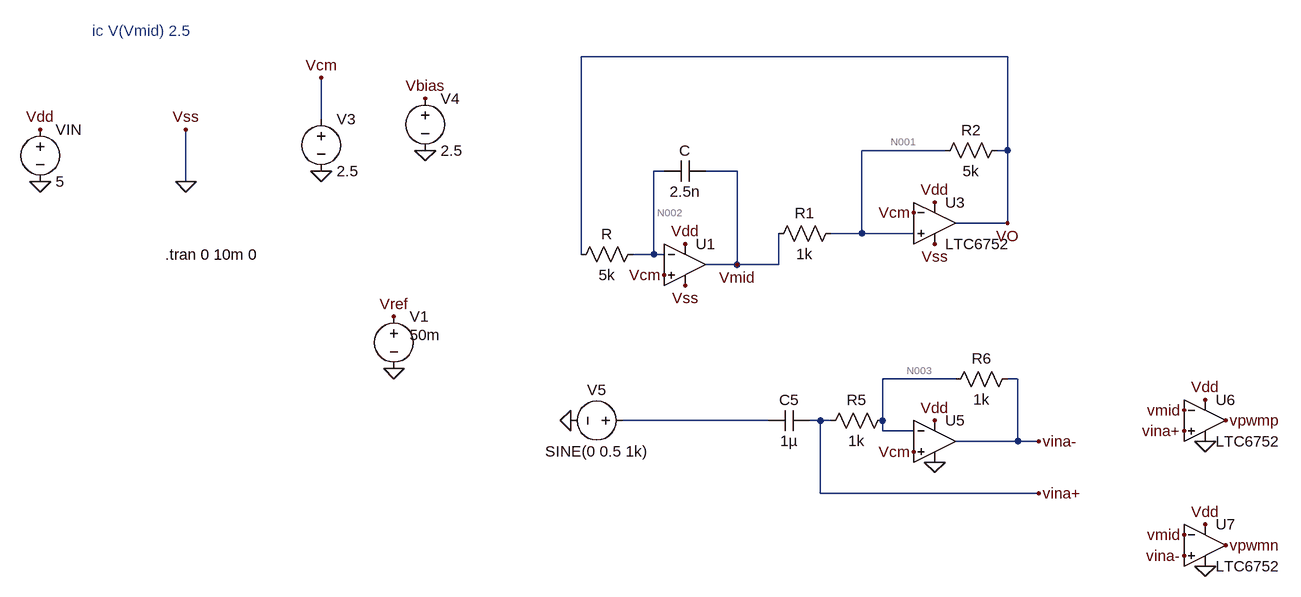
[diagram p0: schematic Single_to_diffn.asc]
Single_to_diffn.asc, the LTspice schematic file:
Version 4
SHEET 1 2520 1916
WIRE 624 -128 -32 -128
WIRE -432 -32 -432 -96
WIRE 528 16 400 16
WIRE 624 16 624 -128
WIRE 624 16 608 16
WIRE 96 48 80 48
WIRE 208 48 160 48
WIRE -640 64 -640 -16
WIRE 624 128 624 16
WIRE 624 128 544 128
WIRE 400 144 400 16
WIRE 400 144 352 144
WIRE 480 144 400 144
WIRE -32 176 -32 -128
WIRE 80 176 80 48
WIRE 80 176 48 176
WIRE 96 176 80 176
WIRE 208 192 208 48
WIRE 208 192 160 192
WIRE 272 192 272 144
WIRE 272 192 208 192
WIRE 544 368 432 368
WIRE 640 368 624 368
WIRE 256 432 32 432
WIRE 336 432 320 432
WIRE 352 432 336 432
WIRE 432 432 432 368
WIRE 432 448 432 432
WIRE 480 448 432 448
WIRE 640 464 640 368
WIRE 640 464 544 464
WIRE 672 464 640 464
WIRE 336 544 336 432
WIRE 672 544 336 544
FLAG 128 224 Vss
FLAG 512 160 Vss
FLAG -640 -16 Vss
FLAG 96 208 Vcm
FLAG 480 112 Vcm
FLAG -640 64 0
FLAG -864 64 0
FLAG 624 128 VO
FLAG 208 192 Vmid
FLAG 512 96 Vdd
FLAG 128 160 Vdd
FLAG -864 -16 Vdd
FLAG -432 -96 Vcm
FLAG -432 48 0
FLAG -272 -64 Vbias
FLAG -272 16 0
FLAG -320 272 Vref
FLAG -320 352 0
FLAG 480 480 Vcm
FLAG 672 464 vina-
FLAG 672 544 vina+
FLAG -48 432 0
FLAG 512 432 Vdd
FLAG 512 496 0
FLAG 928 400 Vdd
FLAG 928 592 Vdd
FLAG 928 464 0
FLAG 928 656 0
FLAG 896 416 vmid
FLAG 896 608 vmid
FLAG 896 640 vina-
FLAG 896 448 vina+
FLAG 960 432 vpwmp
FLAG 960 624 vpwmn
DATAFLAG 272 192 ""
SYMBOL Opamps\\UniversalOpamp2 128 192 R0
SYMATTR InstName U1
SYMBOL res 64 160 R90
WINDOW 0 0 56 VBottom 2
WINDOW 3 32 56 VTop 2
SYMATTR InstName R
SYMATTR Value 5k
SYMBOL res 368 128 R90
WINDOW 0 0 56 VBottom 2
WINDOW 3 32 56 VTop 2
SYMATTR InstName R1
SYMATTR Value 1k
SYMBOL res 624 0 R90
WINDOW 0 0 56 VBottom 2
WINDOW 3 32 56 VTop 2
SYMATTR InstName R2
SYMATTR Value 5k
SYMBOL cap 160 32 R90
WINDOW 0 0 32 VBottom 2
WINDOW 3 32 32 VTop 2
SYMATTR InstName C
SYMATTR Value 2.5n
SYMBOL voltage -864 -32 R0
WINDOW 123 0 0 Left 0
WINDOW 39 0 0 Left 0
SYMATTR InstName VIN
SYMATTR Value 5
SYMBOL voltage -432 -48 R0
WINDOW 123 0 0 Left 0
WINDOW 39 0 0 Left 0
SYMATTR InstName V3
SYMATTR Value 2.5
SYMBOL Comparators\\LTC6752 512 64 R0
SYMATTR InstName U3
SYMBOL voltage -272 -80 R0
WINDOW 123 0 0 Left 0
WINDOW 39 0 0 Left 0
SYMATTR InstName V4
SYMATTR Value 2.5
SYMBOL voltage -320 256 R0
WINDOW 123 24 124 Left 2
WINDOW 39 0 0 Left 0
WINDOW 3 24 44 Left 2
SYMATTR Value 50m
SYMATTR InstName V1
SYMBOL voltage 48 432 R90
WINDOW 0 -32 56 VBottom 2
WINDOW 3 32 56 VTop 2
WINDOW 123 0 0 Left 0
WINDOW 39 0 0 Left 0
SYMATTR InstName V5
SYMATTR Value SINE(0 0.5 1k)
SYMBOL cap 320 416 R90
WINDOW 0 0 32 VBottom 2
WINDOW 3 32 32 VTop 2
SYMATTR InstName C5
SYMATTR Value 1µ
SYMBOL res 448 416 R90
WINDOW 0 0 56 VBottom 2
WINDOW 3 32 56 VTop 2
SYMATTR InstName R5
SYMATTR Value 1k
SYMBOL res 640 352 R90
WINDOW 0 0 56 VBottom 2
WINDOW 3 32 56 VTop 2
SYMATTR InstName R6
SYMATTR Value 1k
SYMBOL Opamps\\UniversalOpamp2 512 464 R0
SYMATTR InstName U5
SYMBOL Comparators\\LTC6752 928 368 R0
SYMATTR InstName U6
SYMBOL Comparators\\LTC6752 928 560 R0
SYMATTR InstName U7
TEXT -672 176 Left 2 !.tran 0 10m 0
TEXT -784 -168 Left 2 ;ic V(Vmid) 2.5

The netlist it stands for:
* Single_to_diffn.asc
XU1 Vcm N002 Vdd 0 Vmid level.2 Avol=1Meg GBW=10Meg Slew=10Meg ilimit=25m rail=0 Vos=0 phimargin=45 en=0 enk=0 in=0 ink=0 Rin=500Meg  ; pins IN+ IN- V+ V- OUT
R N002 VO 5k
R1 N001 Vmid 1k
R2 VO N001 5k
C Vmid N002 2.5n
VIN Vdd 0 5
V3 Vcm 0 2.5
XU3 N001 Vcm Vdd 0 VO LTC6752  ; pins In+ In- V+ V- OUT
V4 Vbias 0 2.5
V1 Vref 0 50m
V5 N004 0 SINE(0 0.5 1k)
C5 vina+ N004 1µ
R5 N003 vina+ 1k
R6 vina- N003 1k
XU5 Vcm N003 Vdd 0 vina- level.2 Avol=1Meg GBW=10Meg Slew=10Meg ilimit=25m rail=0 Vos=0 phimargin=45 en=0 enk=0 in=0 ink=0 Rin=500Meg  ; pins IN+ IN- V+ V- OUT
XU6 vina+ Vmid Vdd 0 vpwmp LTC6752  ; pins In+ In- V+ V- OUT
XU7 vina- Vmid Vdd 0 vpwmn LTC6752  ; pins In+ In- V+ V- OUT
.tran 0 10m 0
* ic V(Vmid) 2.5
.lib UniversalOpamps2.sub
.lib LTC7.lib
.backanno
.end

* Results of the author's LTspice run, read from the files saved beside the schematic
* Operating Point, zero values left out:
*   V(vmid) = 2.499 V
*   V(vdd) = 5 V
*   V(n002) = 2.5 V
*   V(vcm) = 2.5 V
*   V(vo) = 2.5 V
*   V(n001) = 2.5 V
*   V(vbias) = 2.5 V
*   V(vref) = 50 mV
*   V(vina+) = 2.501 V
*   V(n003) = 2.5 V
*   V(vina-) = 2.499 V
*   V(vpwmp) = 5 V
*   V(vpwmn) = 5 V
*   I(R6) = -1.075 µA
*   I(R5) = -1.075 µA
*   I(R2) = 60.41 nA
*   I(R1) = 1.185 µA
*   I(V3) = 1.115 µA
*   I(Vin) = -23.4 mA